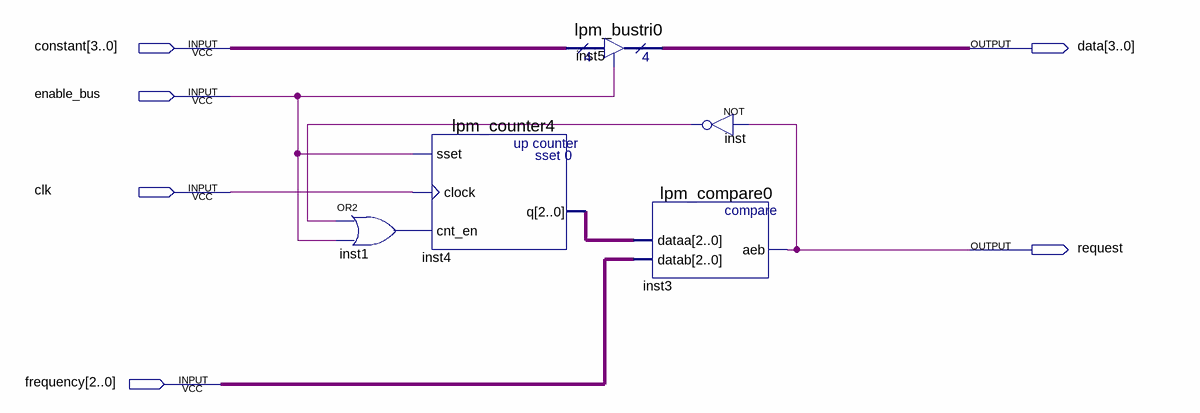
[diagram p0: schematic sheet]
// Quartus schematic Device.bdf as structural Verilog: 5 symbols, 6 pins
module Device (
  input  [3:0] constant,
  input  enable_bus,
  input  clk,
  input  [2:0] frequency,
  output [3:0] data,
  output request
);

  wire inst1_out, inst_out;
  wire [2:0] inst4_q;

  or inst1 (inst1_out, inst_out, enable_bus);
  lpm_counter4 inst4 (.sset(enable_bus), .clock(clk), .cnt_en(inst1_out), .q(inst4_q));
  lpm_bustri0 inst5 (.enabledt(enable_bus), .data(constant), .tridata(data));
  lpm_compare0 inst3 (.dataa(inst4_q), .datab(frequency), .aeb(request));
  not inst (inst_out, request);
endmodule
